# Altium project 工业控制板.PrjPcb
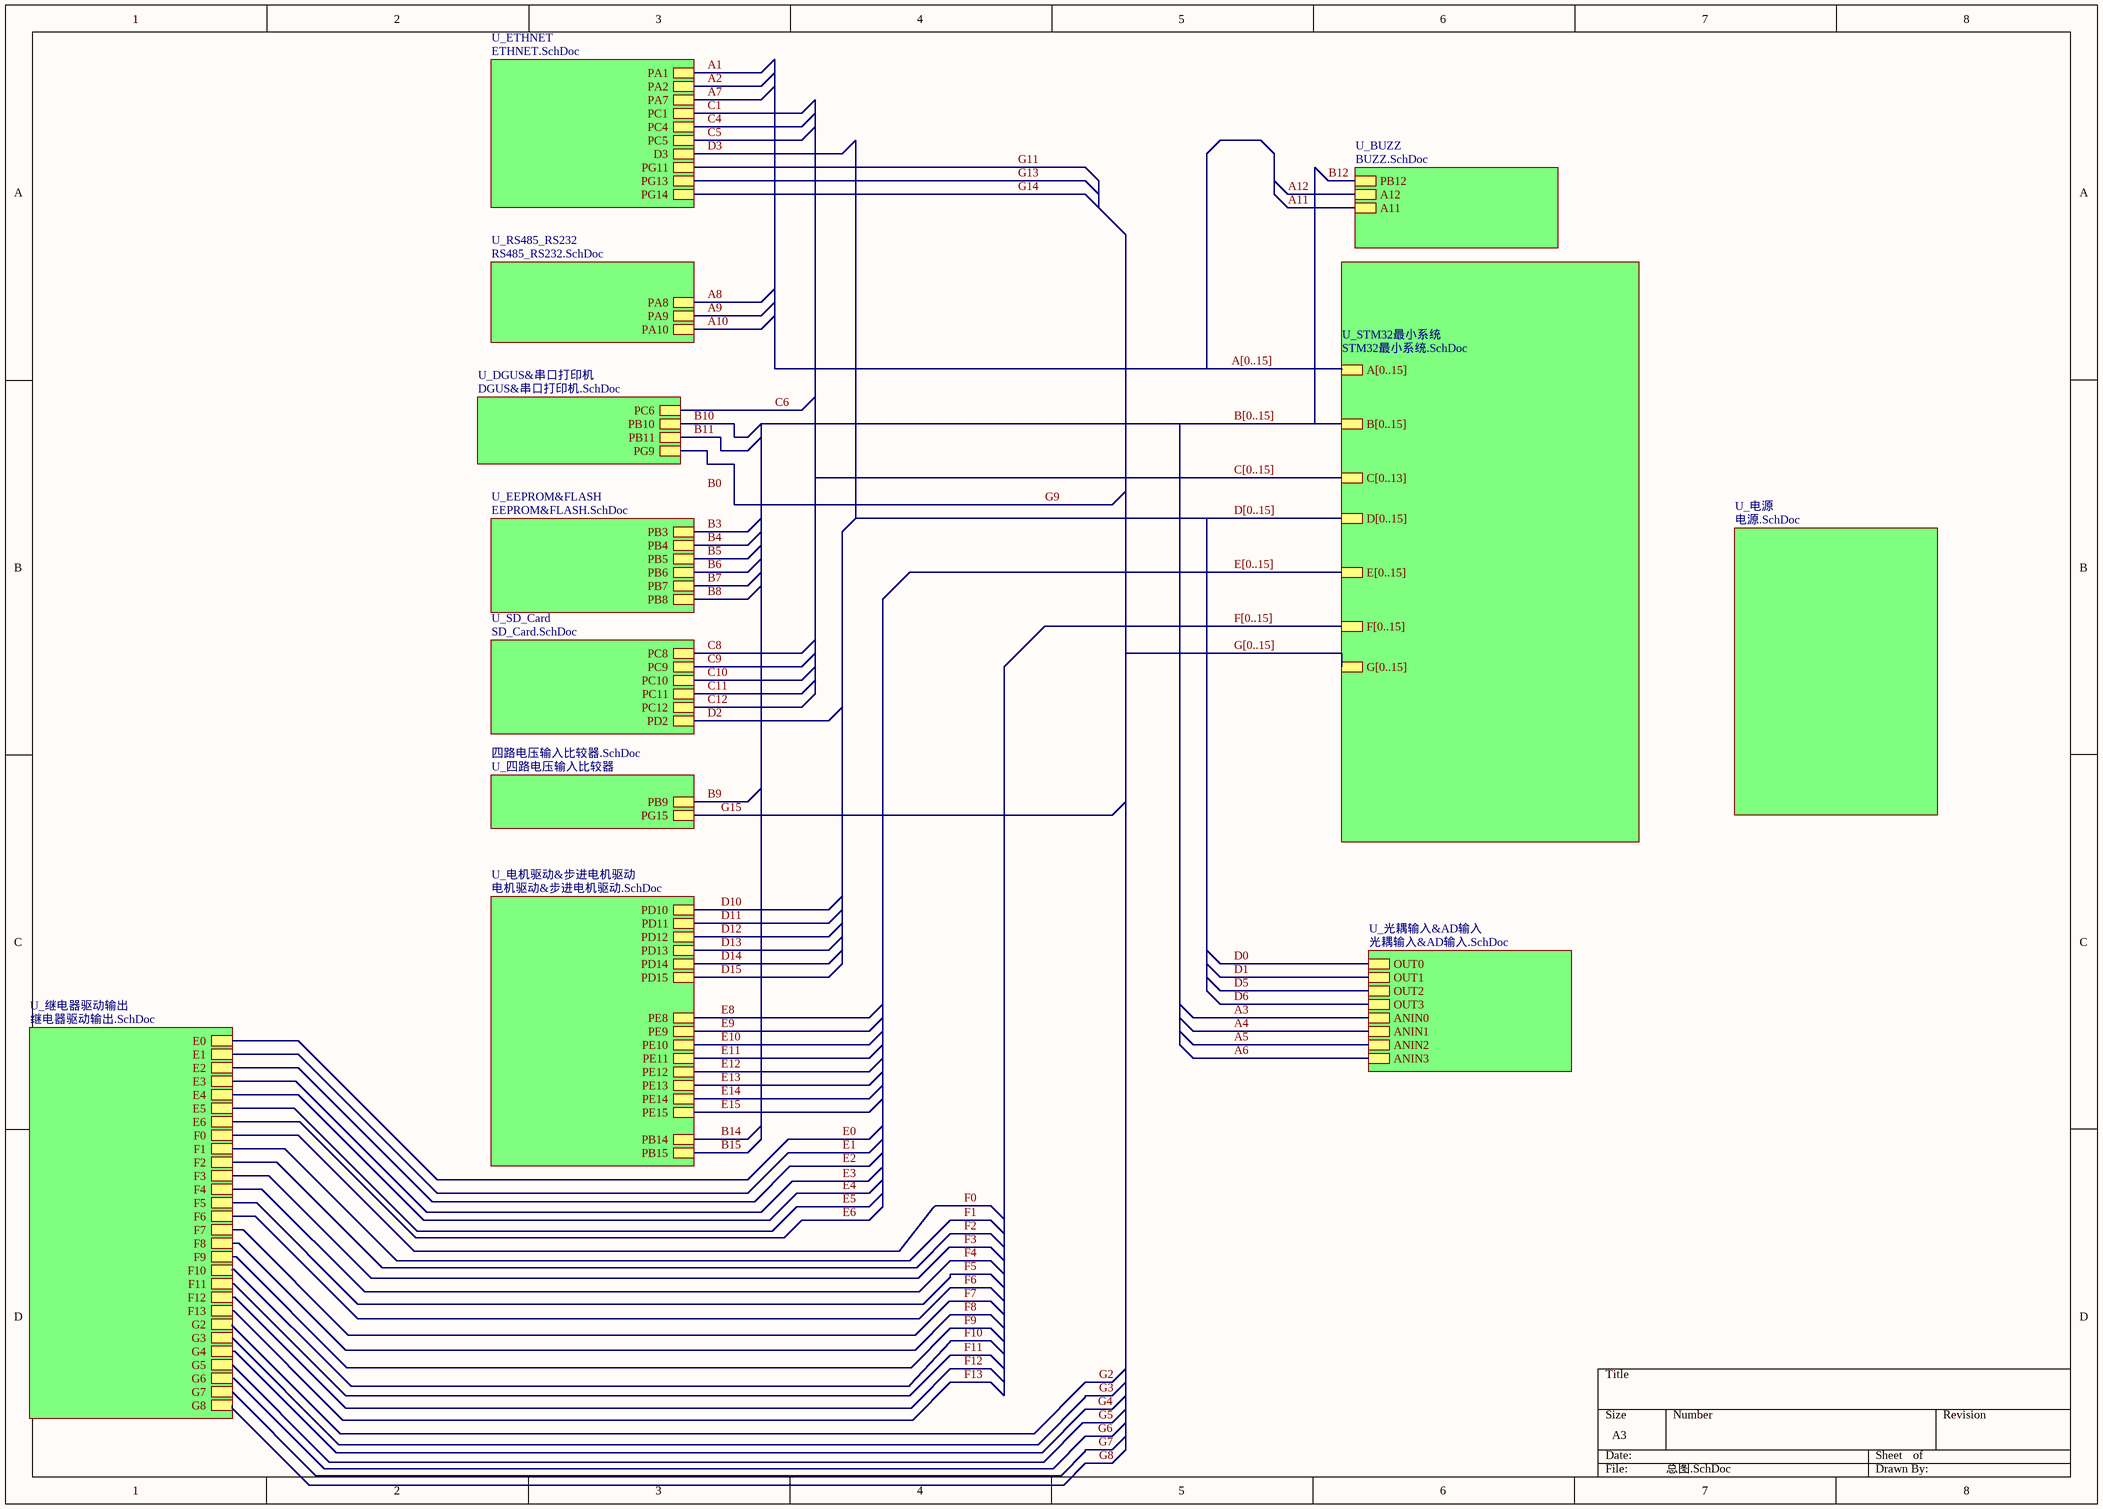
[diagram p0: 总图.SchDoc]
8 sheets, 180 parts. Net scope: hierarchical (ports join the sheet entries above them; power ports are global).
Board file: 工控板PCB.PcbDoc
Sheets:
  总图.SchDoc
    U_RS485_RS232 = RS485_RS232.SchDoc
    U_SD_Card = SD_Card.SchDoc
    U_EEPROM&FLASH = EEPROM&FLASH.SchDoc
    U_电机驱动&步进电机驱动 = 电机驱动&步进电机驱动.SchDoc
    U_继电器驱动输出 = 继电器驱动输出.SchDoc
    U_BUZZ = BUZZ.SchDoc
    U_光耦输入&AD输入 = 光耦输入&AD输入.SchDoc

## Sheet 总图.SchDoc
size A3

### Sub-sheets
U_BUZZ = BUZZ.SchDoc: PB12, A12, A11
U_DGUS&串口打印机 = DGUS&串口打印机.SchDoc (file not in this document): PG9, PB11, PC6, PB10
U_EEPROM&FLASH = EEPROM&FLASH.SchDoc: PB8, PB4, PB5, PB3, PB6, PB7
U_ETHNET = ETHNET.SchDoc (file not in this document): PA2, PC1, PG13, PG14, PG11, PC4, PC5, PA7, PA1, D3
U_RS485_RS232 = RS485_RS232.SchDoc: PA10, PA9, PA8
U_SD_Card = SD_Card.SchDoc: PC8, PC9, PC10, PC11, PC12, PD2
U_STM32最小系统 = STM32最小系统.SchDoc (file not in this document): A[0..15], B[0..15], C[0..13], D[0..15], E[0..15], F[0..15], G[0..15]
U_光耦输入&AD输入 = 光耦输入&AD输入.SchDoc: OUT0, OUT1, OUT2, OUT3, ANIN0, ANIN1, ANIN2, ANIN3
U_四路电压输入比较器 = 四路电压输入比较器.SchDoc (file not in this document): PG15, PB9
U_电机驱动&步进电机驱动 = 电机驱动&步进电机驱动.SchDoc: PE15, PE14, PE13, PE12, PE11, PE10, PE9, PE8, PD14, PD15, PB14, PB15, PD12, PD13, PD11, PD10
U_电源 = 电源.SchDoc (file not in this document): no entries
U_继电器驱动输出 = 继电器驱动输出.SchDoc: F0, F1, F2, F3, F4, F5, F6, E0, E1, E2, E3, E4, E5, E6, F7, F8, F9, F10, F11, F12, F13, G2, G3, G4, G5, G6, G7, G8

### Nets
A1: sheet U_ETHNET/PA1
A2: sheet U_ETHNET/PA2
A5: sheet U_光耦输入&AD输入/ANIN2
A6: sheet U_光耦输入&AD输入/ANIN3
A7: sheet U_ETHNET/PA7
B9: sheet U_四路电压输入比较器/PB9
B10: sheet U_DGUS&串口打印机/PB10
B11: sheet U_DGUS&串口打印机/PB11
C1: sheet U_ETHNET/PC1
C4: sheet U_ETHNET/PC4
C5: sheet U_ETHNET/PC5
C6: sheet U_DGUS&串口打印机/PC6
D3: sheet U_ETHNET/D3
D5: sheet U_光耦输入&AD输入/OUT2
D6: sheet U_光耦输入&AD输入/OUT3
G2: sheet U_继电器驱动输出/G2
G3: sheet U_继电器驱动输出/G3
G4: sheet U_继电器驱动输出/G4
G5: sheet U_继电器驱动输出/G5
G6: sheet U_继电器驱动输出/G6
G7: sheet U_继电器驱动输出/G7
G8: sheet U_继电器驱动输出/G8
G9: sheet U_DGUS&串口打印机/PG9
G11: sheet U_ETHNET/PG11
G13: sheet U_ETHNET/PG13
G14: sheet U_ETHNET/PG14
G15: sheet U_四路电压输入比较器/PG15

### Buses and harness runs
bus A[0..15] = sheet U_STM32最小系统/A[0..15]
bus B[0..15] = sheet U_STM32最小系统/B[0..15]
bus C[0..15] = sheet U_STM32最小系统/C[0..13]
bus D[0..15] = sheet U_STM32最小系统/D[0..15]
bus E[0..15] = sheet U_STM32最小系统/E[0..15]
bus F[0..15] = sheet U_STM32最小系统/F[0..15]
bus G[0..15] = sheet U_STM32最小系统/G[0..15]

### Notes on the sheet
- Labels drawn without touching a wire or pin: B0

## Sheet RS485_RS232.SchDoc
size 152 x 152 mm
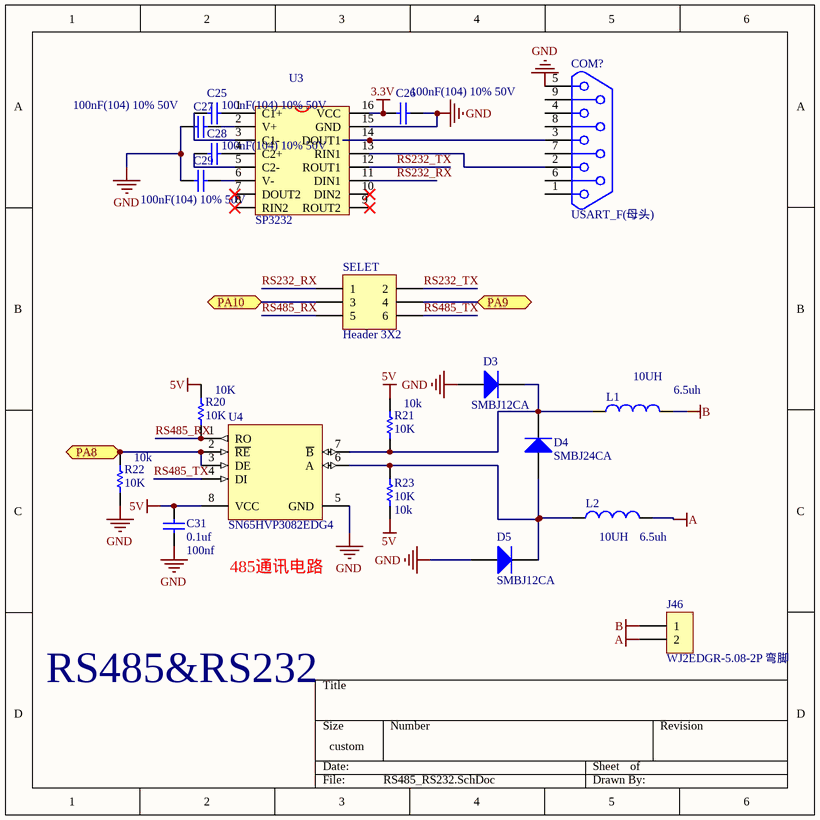
[diagram p1: RS485_RS232.SchDoc]

### Parts
C25  100nF(104) 10% 50V  [0805_C]
C26  100nF(104) 10% 50V  [0805_C]
C27  100nF(104) 10% 50V  [0805_C]
C28  100nF(104) 10% 50V  [0805_C]
C29  100nF(104) 10% 50V  [0805_C]
C31  0.1uf  value 100nf  [0805_C]
COM?  USART_F(母头)  [DB9]
D3  SMBJ12CA  [SMBJ]
D4  SMBJ24CA  [SMBJ]
D5  SMBJ12CA  [SMBJ]
J46  WJ2EDGR-5.08-2P 弯脚  [WJ2EDGR-5.08-2]
L1  10UH  value 6.5uh  [0805]
L2  10UH  value 6.5uh  [0805]
R20  10K  [0805]
R21  10K  [0805]
R22  10K  [0805]
R23  10K  [0805]
SELET  Header 3X2  [HDR2X3]
U3  SP3232  [SOP16M]
U4  SN65HVP3082EDG4  [SOIC-8_150mil]

### Ports
PA8, PA9, PA10

### Nets
3.3V: C26.2 U3.16(VCC)
5V: C31.2 R20.2 R21.2 R23.1 U4.8(VCC)
A: J46.2 L2.2
B: J46.1 L1.2
GND: C26.1 C27.1 C29.1 C31.1 COM?.5 D3.1(A) D5.1(A) R22.1 U3.15(GND) U4.5(GND)
A8: R22.2 U4.2(~{RE}) U4.3(DE) ; port PA8
A9: SELET.4 ; port PA9
A10: SELET.3 ; port PA10
RS232_RX: SELET.1 U3.11(DIN1)
RS232_TX: SELET.2 U3.12(ROUT1)
RS485_RX: R20.1 SELET.5 U4.1(RO)
RS485_TX: SELET.6 U4.4(DI)
NetC25_1: C25.1 U3.3(C1-)
NetC25_2: C25.2 U3.1(C1+)
NetC27_2: C27.2 U3.2(V+)
NetC28_1: C28.1 U3.5(C2-)
NetC28_2: C28.2 U3.4(C2+)
NetC29_2: C29.2 U3.6(V-)
NetCOM?_2: COM?.2 U3.13(RIN1)
NetCOM?_3: COM?.3 U3.14(DOUT1)
NetD3_2: D3.2(K) D4.2(K) L1.1 R21.1 U4.7(~{B})
NetD4_1: D4.1(A) D5.2(K) L2.1 R23.2 U4.6(A)

Not connected (* = marked no-connect by the designer): COM? 1 4 6 7 8 9; U3 7(DOUT2)* 8(RIN2)* 9(ROUT2)* 10(DIN2)*

### Notes on the sheet
- 485通讯电路
- RS485&RS232

### Library data of the parts
C25-C29 = 0805 100nF(104) 10% 50V: 贴片电容; ComponentLink1Description: 供应商链接; ComponentLink1URL: http://www.szlcsc.com/product/details_50686.html; Package: 0805; Supplier: LC; SuppliersPartNumber: C49678
C31 = Cap: Capacitor; Published: 8-Jun-2000; LatestRevisionDate: 17-Jul-2002; LatestRevisionNote: Re-released for DXP Platform.; PackageReference: RAD-0.3; Publisher: Altium Limited; PackageDescription: Radial Cap, Thru-Hole; 2 Leads; 0.3 in Pin Spacing
COM? = DB9
D3-D5 = SMA(DO-214AC) SS210: 二极管; ComponentLink1Description: 供应商链接; ComponentLink1URL: http://www.szlcsc.com/product/details_15669.html; Package: SMA(DO-214AC); Supplier: LC; SuppliersPartNumber: C14996
J46 = WJ2EDGR-5.08-2P 弯脚: 2EDG连接器; ComponentLink1URL: https://detail.tmall.com/item.htm?spm=a1z10.5-b.w4011-14865958799.85.B0p41N&id=45355509244&rn=e90e7252b5175cd006380c5c01151190&abbucket=9; price: 0.28; Supplier: Farpu; SuppliersPartNumber: *; Manufacturer: *; ComponentLink1Description: 供应商链接
L1 L2 = Inductor: Code_IEC: 1005; Published: 8-Jun-2000; LatestRevisionDate: 29-May-2009; LatestRevisionNote: IPC-7351 Footprint Added.; PackageReference: 0402-A; Publisher: Altium Limited; PackageDescription: Chip Inductor; Code_JEITA: 0402
R20-R23 = Res1: Resistor; Published: 8-Jun-2000; LatestRevisionDate: 17-Jul-2002; LatestRevisionNote: Re-released for DXP Platform.; PackageReference: AXIAL-0.3; Publisher: Altium Limited; PackageDescription: Axial Device, Thru-Hole; 2 Leads; 0.3 in Pin Spacing
  R20: Value: 10K
  R21-R23: Value: 10k
SELET = Header 3X2: Header, 3-Pin, Dual row; LatestRevisionDate: 17-Jul-2002; LatestRevisionNote: Re-released for DXP Platform.; Publisher: Altium Limited
U3 = MAX3232
U4 = SN75176BDR_[C7063]: RS-485/RS-422; ComponentLink1Description: 供应商链接; ComponentLink1URL: http://www.szlcsc.com/product/details_7535.html; Package: SOIC-8_150mil; Supplier: LC; SuppliersPartNumber: C7063

## Sheet SD_Card.SchDoc
size 101 x 76 mm
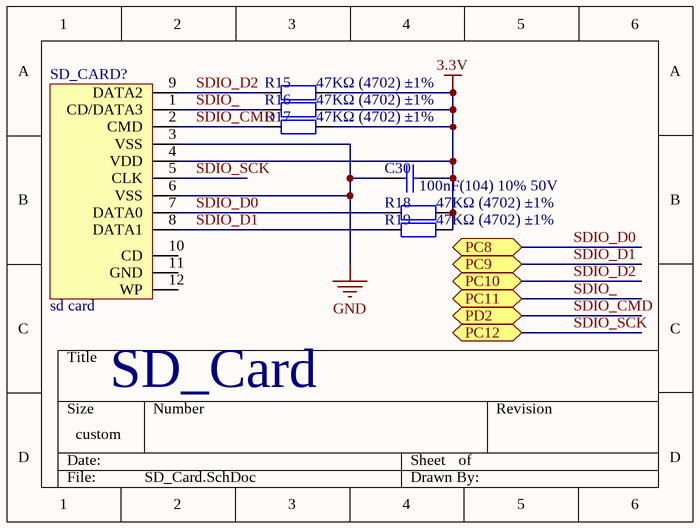
[diagram p2: SD_Card.SchDoc]

### Parts
C30  100nF(104) 10% 50V  [0805_C]
R15  47KΩ (4702) ±1%  [0805_R]
R16  47KΩ (4702) ±1%  [0805_R]
R17  47KΩ (4702) ±1%  [0805_R]
R18  47KΩ (4702) ±1%  [0805_R]
R19  47KΩ (4702) ±1%  [0805_R]
SD_CARD?  sd card  [SDCARD_L]

### Ports
PC8, PC9, PC10, PC11, PC12, PD2

### Nets
3.3V: C30.2 R15.2 R16.2 R17.2 R18.2 R19.2 SD_CARD?.4(VDD)
GND: C30.1 SD_CARD?.3(VSS) SD_CARD?.6(VSS)
SDIO_: R16.1 SD_CARD?.1(CD/DATA3) ; port PC11  [project net C11]
SDIO_CMD: R17.1 SD_CARD?.2(CMD) ; port PD2  [project net D2]
SDIO_D0: R18.1 SD_CARD?.7(DATA0) ; port PC8  [project net C8]
SDIO_D1: R19.1 SD_CARD?.8(DATA1) ; port PC9  [project net C9]
SDIO_D2: R15.1 SD_CARD?.9(DATA2) ; port PC10  [project net C10]
SDIO_SCK: SD_CARD?.5(CLK) ; port PC12  [project net C12]

Not connected (* = marked no-connect by the designer): SD_CARD? 10(CD) 11(GND) 12(WP)

### Notes on the sheet
- (near SD_CARD?) SD_Card

### Library data of the parts
C30 = 0805 100nF(104) 10% 50V: 贴片电容; ComponentLink1Description: 供应商链接; ComponentLink1URL: http://www.szlcsc.com/product/details_50686.html; Package: 0805; Supplier: LC; SuppliersPartNumber: C49678
R15-R19 = 0805 47KΩ (4702) 1%: 贴片电阻; ComponentLink1Description: 供应商链接; ComponentLink1URL: http://www.szlcsc.com/product/details_18401.html; Package: 0805; Supplier: LC; SuppliersPartNumber: C17713

## Sheet EEPROM&FLASH.SchDoc
size 101 x 101 mm
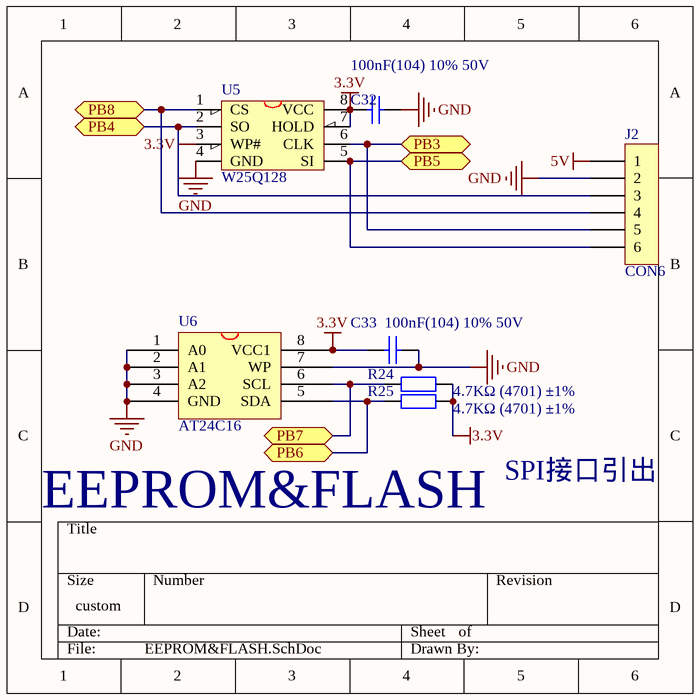
[diagram p3: EEPROM&FLASH.SchDoc]

### Parts
C32  100nF(104) 10% 50V  [0805_C]
C33  100nF(104) 10% 50V  [0805_C]
J2  CON6  [XH2.54-6P]
R24  4.7KΩ (4701) ±1%  [0805_R]
R25  4.7KΩ (4701) ±1%  [0805_R]
U5  W25Q128  [SOIC-8]
U6  AT24C16  [SOP-8]

### Ports
PB3, PB4, PB5, PB6, PB7, PB8

### Nets
3.3V: C32.1 C33.1 R24.2 R25.2 U5.3(WP#) U5.7(HOLD) U5.8(VCC) U6.8(VCC1)
5V: J2.1
GND: C32.2 C33.2 J2.2 U5.4(GND) U6.1(A0) U6.2(A1) U6.3(A2) U6.4(GND) U6.7(WP)
B3: J2.5 U5.6(CLK) ; port PB3
B4: J2.3 U5.2(SO) ; port PB4
B5: J2.6 U5.5(SI) ; port PB5
B6: R25.1 U6.5(SDA) ; port PB6
B7: R24.1 U6.6(SCL) ; port PB7
B8: J2.4 U5.1(CS) ; port PB8

### Notes on the sheet
- EEPROM&FLASH
- SPI接口引出

### Library data of the parts
C32 C33 = 0805 100nF(104) 10% 50V: 贴片电容; ComponentLink1Description: 供应商链接; ComponentLink1URL: http://www.szlcsc.com/product/details_50686.html; Package: 0805; Supplier: LC; SuppliersPartNumber: C49678
J2 = CON6: 连接器
R24 R25 = 0805 4.7KΩ (4701) 1%: 贴片电阻; ComponentLink1Description: 供应商链接; ComponentLink1URL: http://www.szlcsc.com/product/details_18361.html; Package: 0805; Supplier: LC; SuppliersPartNumber: C17673
U5 = W25X16: W25X16;SST25VF016;MX25L1605
U6 = 24C256

## Sheet 电机驱动&步进电机驱动.SchDoc
size 558 x 241 mm
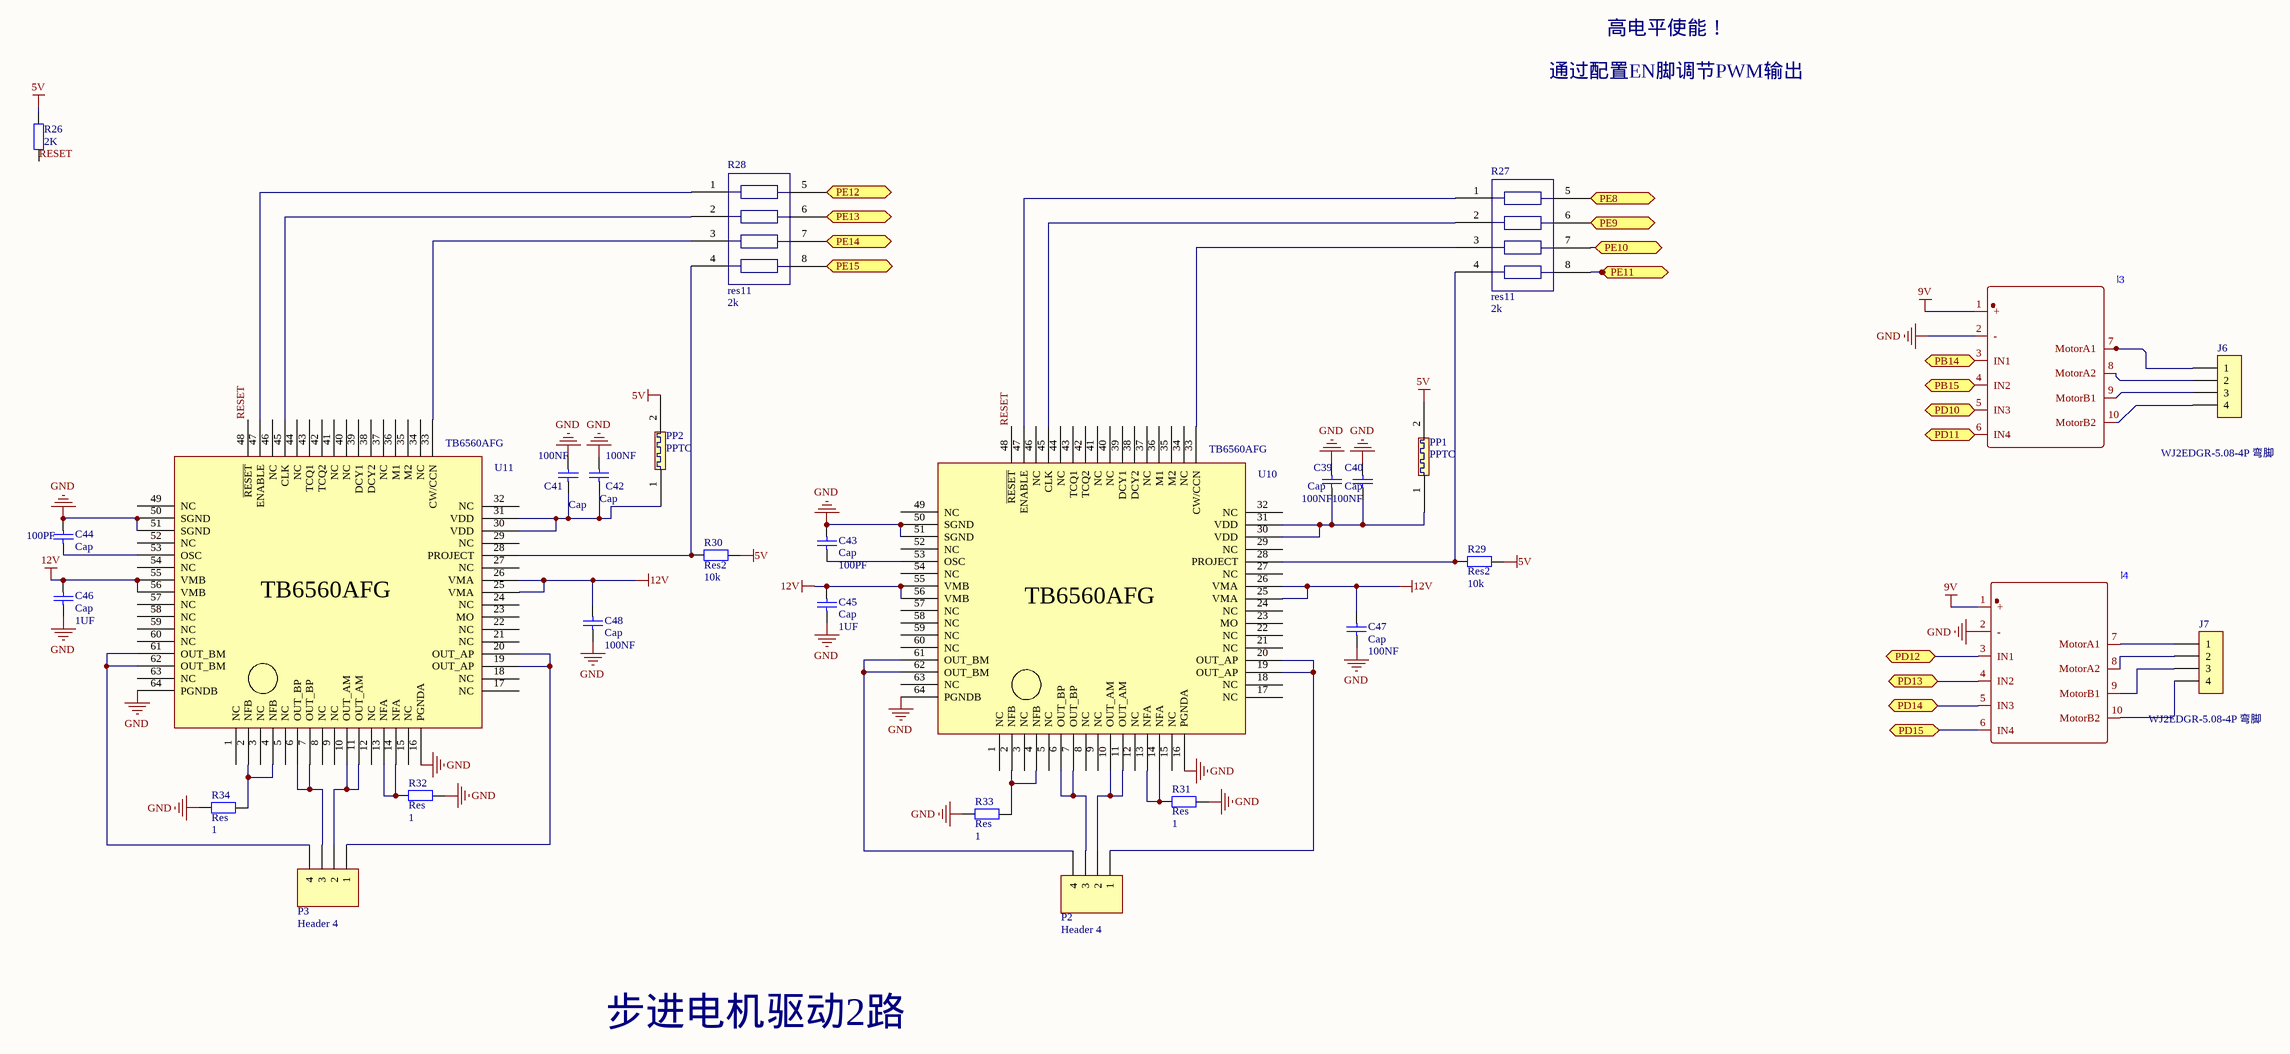
[diagram p4: 电机驱动&步进电机驱动.SchDoc]

### Parts
C39  Cap  value 100NF  [0805_C]
C40  Cap  value 100NF  [0805_C]
C41  Cap  value 100NF  [0805_C]
C42  Cap  value 100NF  [0805_C]
C43  Cap  value 100PF  [0805_C]
C44  Cap  value 100PF  [0805_C]
C45  Cap  value 1UF  [0805_C]
C46  Cap  value 1UF  [0805_C]
C47  Cap  value 100NF  [0805_C]
C48  Cap  value 100NF  [0805_C]
J6  WJ2EDGR-5.08-4P 弯脚  [WJ2EDGR-5.08-4]
J7  WJ2EDGR-5.08-4P 弯脚  [WJ2EDGR-5.08-4]
l3  (no value)  [L298N_MINI]
l4  (no value)  [L298N_MINI]
P2  Header 4  [WJ2EDGR-5.08-4]
P3  Header 4  [WJ2EDGR-5.08-4]
PP1  PPTC  [1206]
PP2  PPTC  [1206]
R26  value 2K  [0805]  (hidden comment: Res2)
R27  res11  value 2k  [RES_PACK4]
R28  res11  value 2k  [RES_PACK4]
R29  Res2  value 10k  [0805]
R30  Res2  value 10k  [0805]
R31  Res  value 1  [2512]
R32  Res  value 1  [2512]
R33  Res  value 1  [2512]
R34  Res  value 1  [2512]
U10  TB6560AFG  [TB6560AFG]
U11  TB6560AFG  [TB6560AFG]

### Ports
PB14, PB15, PD10, PD11, PD12, PD13, PD14, PD15, PE8, PE9, PE10, PE11, PE12, PE13, PE14, PE15

### Nets
5V: PP1.2(B) PP2.2(B) R26.1 R29.1 R30.1
9V: l3.1(+) l4.1(+)
12V: C45.2 C46.2 C47.1 C48.1 U10.25(VMA) U10.26(VMA) U10.55(VMB) U10.56(VMB) U11.25(VMA) U11.26(VMA) U11.55(VMB) U11.56(VMB)
GND: C39.2 C40.2 C41.2 C42.2 C43.2 C44.2 C45.1 C46.1 C47.2 C48.2 l3.2(-) l4.2(-) R31.1 R32.1 R33.2 R34.2 U10.16(PGNDA) U10.50(SGND) U10.51(SGND) U10.64(PGNDB) U11.16(PGNDA) U11.50(SGND) U11.51(SGND) U11.64(PGNDB)
B14: l3.3(IN1) ; port PB14
B15: l3.4(IN2) ; port PB15
D10: l3.5(IN3) ; port PD10
D11: l3.6(IN4) ; port PD11
D12: l4.3(IN1) ; port PD12
D13: l4.4(IN2) ; port PD13
D14: l4.5(IN3) ; port PD14
D15: l4.6(IN4) ; port PD15
E8: R27.5(PGNDB) ; port PE8
E9: R27.6(PGNDB) ; port PE9
E10: R27.7(PGNDB) ; port PE10
E11: R27.8(PGNDB) ; port PE11
E12: R28.5(PGNDB) ; port PE12
E13: R28.6(PGNDB) ; port PE13
E14: R28.7(PGNDB) ; port PE14
E15: R28.8(PGNDB) ; port PE15
RESET: R26.2 U10.48(~{RESET}) U11.48(~{RESET})
NetC39_1: C39.1 C40.1 PP1.1(B) U10.30(VDD) U10.31(VDD)
NetC41_1: C41.1 C42.1 PP2.1(B) U11.30(VDD) U11.31(VDD)
NetC43_1: C43.1 U10.53(OSC)
NetC44_1: C44.1 U11.53(OSC)
NetJ6_1: J6.1 l3.7(MotorA1)
NetJ6_2: J6.2 l3.8(MotorA2)
NetJ6_3: J6.3 l3.9(MotorB1)
NetJ6_4: J6.4 l3.10(MotorB2)
NetJ7_1: J7.1 l4.7(MotorA1)
NetJ7_2: J7.2 l4.8(MotorA2)
NetJ7_3: J7.3 l4.9(MotorB1)
NetJ7_4: J7.4 l4.10(MotorB2)
NetP2_1: P2.1 U10.19(OUT_AP) U10.20(OUT_AP)
NetP2_2: P2.2 U10.10(OUT_AM) U10.11(OUT_AM)
NetP2_3: P2.3 U10.6(OUT_BP) U10.7(OUT_BP)
NetP2_4: P2.4 U10.61(OUT_BM) U10.62(OUT_BM)
NetP3_1: P3.1 U11.19(OUT_AP) U11.20(OUT_AP)
NetP3_2: P3.2 U11.10(OUT_AM) U11.11(OUT_AM)
NetP3_3: P3.3 U11.6(OUT_BP) U11.7(OUT_BP)
NetP3_4: P3.4 U11.61(OUT_BM) U11.62(OUT_BM)
NetR27_1: R27.1(PGNDB) U10.47(ENABLE)
NetR27_2: R27.2(PGNDB) U10.45(CLK)
NetR27_3: R27.3(PGNDB) U10.33(CW/CCN)
NetR27_4: R27.4(PGNDB) R29.2 U10.28(PROJECT)
NetR28_1: R28.1(PGNDB) U11.47(ENABLE)
NetR28_2: R28.2(PGNDB) U11.45(CLK)
NetR28_3: R28.3(PGNDB) U11.33(CW/CCN)
NetR28_4: R28.4(PGNDB) R30.2 U11.28(PROJECT)
NetR31_2: R31.2 U10.13(NFA) U10.14(NFA)
NetR32_2: R32.2 U11.13(NFA) U11.14(NFA)
NetR33_1: R33.1 U10.2(NFB) U10.4(NFB)
NetR34_1: R34.1 U11.2(NFB) U11.4(NFB)

Not connected (* = marked no-connect by the designer): U10 1(NC) 3(NC) 5(NC) 8(NC) 9(NC) 12(NC) 15(NC) 17(NC) 18(NC) 21(NC) 22(NC) 23(MO) 24(NC) 27(NC) 29(NC) 32(NC) 34(NC) 35(M2) 36(M1) 37(NC) 38(DCY2) 39(DCY1) 40(NC) 41(NC) 42(TCQ2) 43(TCQ1) 44(NC) 46(NC) 49(NC) 52(NC) 54(NC) 57(NC) 58(NC) 59(NC) 60(NC) 63(NC); U11 1(NC) 3(NC) 5(NC) 8(NC) 9(NC) 12(NC) 15(NC) 17(NC) 18(NC) 21(NC) 22(NC) 23(MO) 24(NC) 27(NC) 29(NC) 32(NC) 34(NC) 35(M2) 36(M1) 37(NC) 38(DCY2) 39(DCY1) 40(NC) 41(NC) 42(TCQ2) 43(TCQ1) 44(NC) 46(NC) 49(NC) 52(NC) 54(NC) 57(NC) 58(NC) 59(NC) 60(NC) 63(NC)

### Notes on the sheet
- 高电平使能！
- 通过配置EN脚调节PWM输出
- 步进电机驱动2路

### Library data of the parts
C39-C48 = Cap: Capacitor; Published: 8-Jun-2000; LatestRevisionDate: 17-Jul-2002; LatestRevisionNote: Re-released for DXP Platform.; PackageReference: RAD-0.3; Publisher: Altium Limited; PackageDescription: Radial Cap, Thru-Hole; 2 Leads; 0.3 in Pin Spacing
J6 J7 = WJ2EDGR-5.08-4P 弯脚: 2EDG连接器; ComponentLink1URL: https://detail.tmall.com/item.htm?spm=a1z10.5-b.w4011-14865958799.85.B0p41N&id=45355509244&rn=e90e7252b5175cd006380c5c01151190&abbucket=9; price: 0.56; Supplier: Farpu; SuppliersPartNumber: *; Manufacturer: *; ComponentLink1Description: 供应商链接
l3 l4 = l298n_mini
P2 P3 = Header 4: Header, 4-Pin; LatestRevisionDate: 17-Jul-2002; LatestRevisionNote: Re-released for DXP Platform.; Publisher: Altium Limited
R26 R29-R34 = Res2: Resistor; Published: 8-Jun-2000; LatestRevisionDate: 17-Jul-2002; LatestRevisionNote: Re-released for DXP Platform.; PackageReference: AXIAL-0.4; Publisher: Altium Limited; PackageDescription: Axial Device, Thru-Hole; 2 Leads; 0.4 in Pin Spacing

## Sheet 继电器驱动输出.SchDoc
size A2
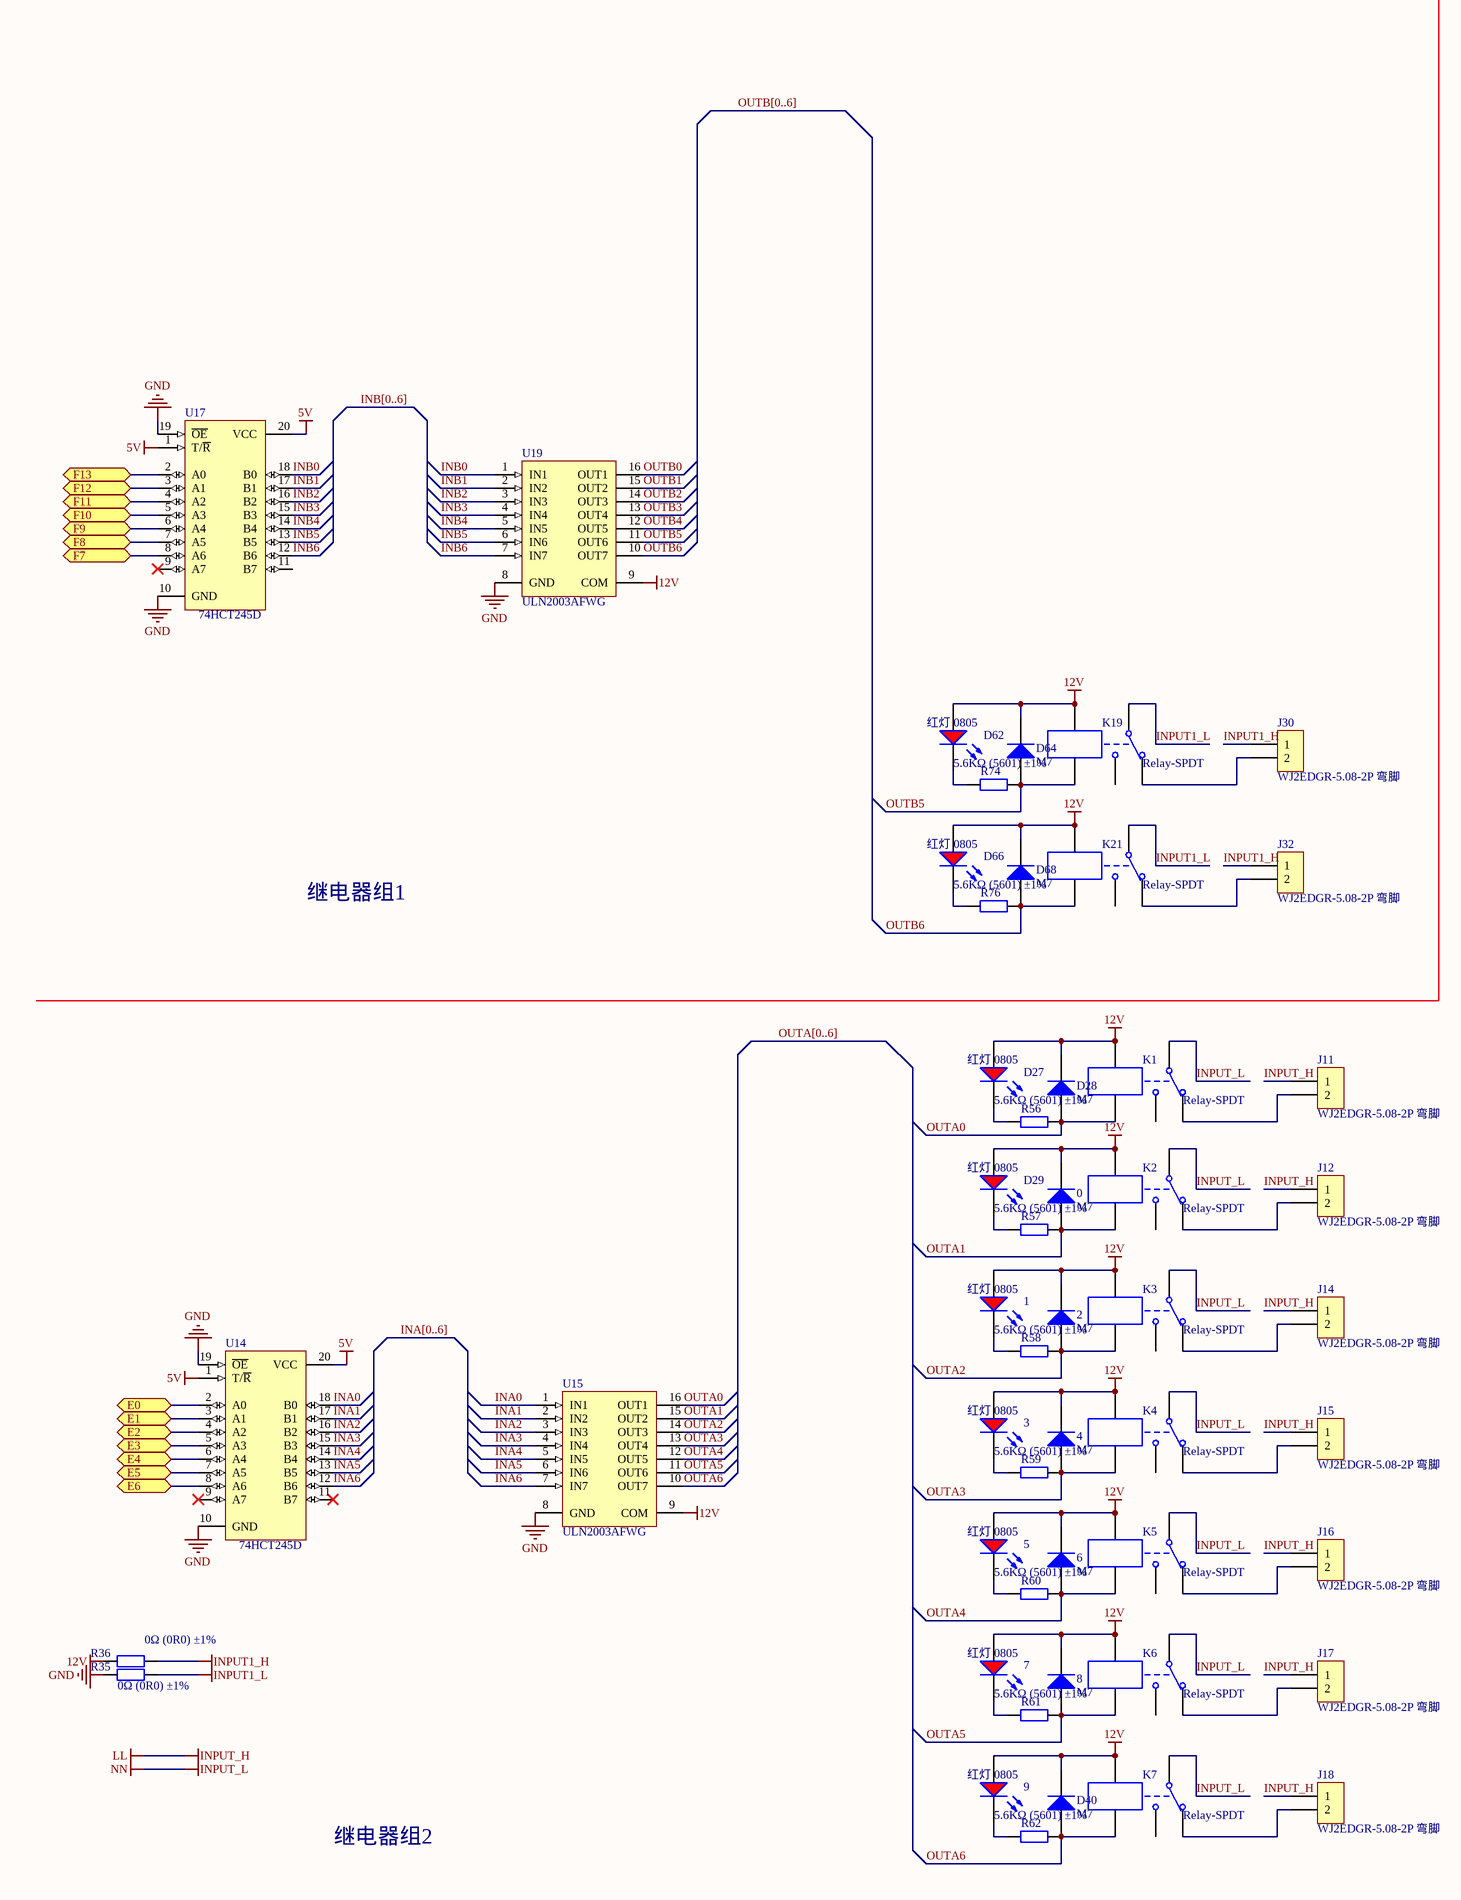
[diagram p5: 继电器驱动输出.SchDoc, left]
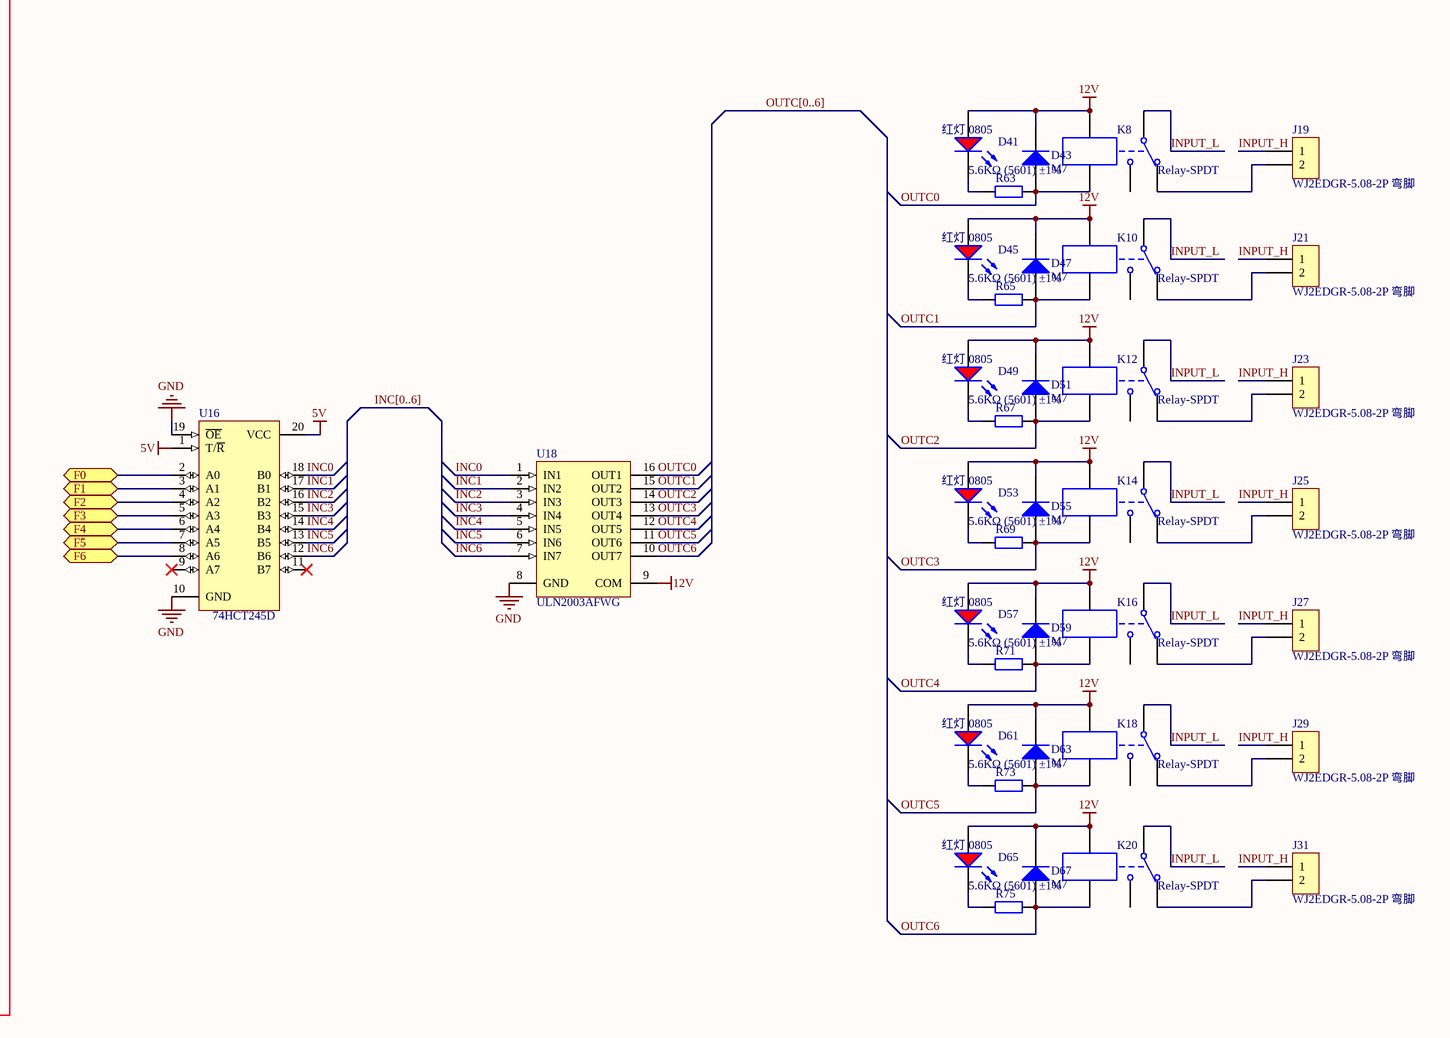
[diagram p6: 继电器驱动输出.SchDoc, right]

### Parts
0  M7  [SMA(DO-214AC)_S1]
1  红灯 0805  [0805_LED_S1]
2  M7  [SMA(DO-214AC)_S1]
3  红灯 0805  [0805_LED_S1]
4  M7  [SMA(DO-214AC)_S1]
5  红灯 0805  [0805_LED_S1]
6  M7  [SMA(DO-214AC)_S1]
7  红灯 0805  [0805_LED_S1]
8  M7  [SMA(DO-214AC)_S1]
9  红灯 0805  [0805_LED_S1]
D27  红灯 0805  [0805_LED_S1]
D28  M7  [SMA(DO-214AC)_S1]
D29  红灯 0805  [0805_LED_S1]
D40  M7  [SMA(DO-214AC)_S1]
D41  红灯 0805  [0805_LED_S1]
D43  M7  [SMA(DO-214AC)_S1]
D45  红灯 0805  [0805_LED_S1]
D47  M7  [SMA(DO-214AC)_S1]
D49  红灯 0805  [0805_LED_S1]
D51  M7  [SMA(DO-214AC)_S1]
D53  红灯 0805  [0805_LED_S1]
D55  M7  [SMA(DO-214AC)_S1]
D57  红灯 0805  [0805_LED_S1]
D59  M7  [SMA(DO-214AC)_S1]
D61  红灯 0805  [0805_LED_S1]
D62  红灯 0805  [0805_LED_S1]
D63  M7  [SMA(DO-214AC)_S1]
D64  M7  [SMA(DO-214AC)_S1]
D65  红灯 0805  [0805_LED_S1]
D66  红灯 0805  [0805_LED_S1]
D67  M7  [SMA(DO-214AC)_S1]
D68  M7  [SMA(DO-214AC)_S1]
J11  WJ2EDGR-5.08-2P 弯脚  [WJ2EDGR-5.08-2]
J12  WJ2EDGR-5.08-2P 弯脚  [WJ2EDGR-5.08-2]
J14  WJ2EDGR-5.08-2P 弯脚  [WJ2EDGR-5.08-2]
J15  WJ2EDGR-5.08-2P 弯脚  [WJ2EDGR-5.08-2]
J16  WJ2EDGR-5.08-2P 弯脚  [WJ2EDGR-5.08-2]
J17  WJ2EDGR-5.08-2P 弯脚  [WJ2EDGR-5.08-2]
J18  WJ2EDGR-5.08-2P 弯脚  [WJ2EDGR-5.08-2]
J19  WJ2EDGR-5.08-2P 弯脚  [WJ2EDGR-5.08-2]
J21  WJ2EDGR-5.08-2P 弯脚  [WJ2EDGR-5.08-2]
J23  WJ2EDGR-5.08-2P 弯脚  [WJ2EDGR-5.08-2]
J25  WJ2EDGR-5.08-2P 弯脚  [WJ2EDGR-5.08-2]
J27  WJ2EDGR-5.08-2P 弯脚  [WJ2EDGR-5.08-2]
J29  WJ2EDGR-5.08-2P 弯脚  [WJ2EDGR-5.08-2]
J30  WJ2EDGR-5.08-2P 弯脚  [WJ2EDGR-5.08-2]
J31  WJ2EDGR-5.08-2P 弯脚  [WJ2EDGR-5.08-2]
J32  WJ2EDGR-5.08-2P 弯脚  [WJ2EDGR-5.08-2]
K1  Relay-SPDT  [继电器5脚]
K2  Relay-SPDT  [继电器5脚]
K3  Relay-SPDT  [继电器5脚]
K4  Relay-SPDT  [继电器5脚]
K5  Relay-SPDT  [继电器5脚]
K6  Relay-SPDT  [继电器5脚]
K7  Relay-SPDT  [继电器5脚]
K8  Relay-SPDT  [继电器5脚]
K10  Relay-SPDT  [继电器5脚]
K12  Relay-SPDT  [继电器5脚]
K14  Relay-SPDT  [继电器5脚]
K16  Relay-SPDT  [继电器5脚]
K18  Relay-SPDT  [继电器5脚]
K19  Relay-SPDT  [继电器5脚]
K20  Relay-SPDT  [继电器5脚]
K21  Relay-SPDT  [继电器5脚]
R35  0Ω (0R0) ±1%  [1206_R]
R36  0Ω (0R0) ±1%  [1206_R]
R56  5.6KΩ (5601) ±1%  [0805_R]
R57  5.6KΩ (5601) ±1%  [0805_R]
R58  5.6KΩ (5601) ±1%  [0805_R]
R59  5.6KΩ (5601) ±1%  [0805_R]
R60  5.6KΩ (5601) ±1%  [0805_R]
R61  5.6KΩ (5601) ±1%  [0805_R]
R62  5.6KΩ (5601) ±1%  [0805_R]
R63  5.6KΩ (5601) ±1%  [0805_R]
R65  5.6KΩ (5601) ±1%  [0805_R]
R67  5.6KΩ (5601) ±1%  [0805_R]
R69  5.6KΩ (5601) ±1%  [0805_R]
R71  5.6KΩ (5601) ±1%  [0805_R]
R73  5.6KΩ (5601) ±1%  [0805_R]
R74  5.6KΩ (5601) ±1%  [0805_R]
R75  5.6KΩ (5601) ±1%  [0805_R]
R76  5.6KΩ (5601) ±1%  [0805_R]
U14  74HCT245D  [SOIC-20_300mil]
U15  ULN2003AFWG  [SOIC-16_150mil]
U16  74HCT245D  [SOIC-20_300mil]
U17  74HCT245D  [SOIC-20_300mil]
U18  ULN2003AFWG  [SOIC-16_150mil]
U19  ULN2003AFWG  [SOIC-16_150mil]

### Ports
E0, E1, E2, E3, E4, E5, E6, F0, F1, F2, F3, F4, F5, F6, F7, F8, F9, F10, F11, F12, F13

### Nets
5V: U14.1(T/~{R}) U14.20(VCC) U16.1(T/~{R}) U16.20(VCC) U17.1(T/~{R}) U17.20(VCC)
12V: 0.2(K) 1.A 2.2(K) 3.A 4.2(K) 5.A 6.2(K) 7.A 8.2(K) 9.A D27.A D28.2(K) D29.A D40.2(K) D41.A D43.2(K) D45.A D47.2(K) D49.A D51.2(K) D53.A D55.2(K) D57.A D59.2(K) D61.A D62.A D63.2(K) D64.2(K) D65.A D66.A D67.2(K) D68.2(K) K1.4 K2.4 K3.4 K4.4 K5.4 K6.4 K7.4 K8.4 K10.4 K12.4 K14.4 K16.4 K18.4 K19.4 K20.4 K21.4 R35.1 U15.9(COM) U18.9(COM) U19.9(COM)
GND: R36.1 U14.10(GND) U14.19(~{OE}) U15.8(GND) U16.10(GND) U16.19(~{OE}) U17.10(GND) U17.19(~{OE}) U18.8(GND) U19.8(GND)
INPUT1_H: J30.1 J32.1 R35.2
INPUT1_L: K19.1 K21.1 R36.2
INPUT_H: J11.1 J12.1 J14.1 J15.1 J16.1 J17.1 J18.1 J19.1 J21.1 J23.1 J25.1 J27.1 J29.1 J31.1  [also labelled LL]
INPUT_L: K1.1 K2.1 K3.1 K4.1 K5.1 K6.1 K7.1 K8.1 K10.1 K12.1 K14.1 K16.1 K18.1 K20.1  [also labelled NN]
E0: U14.2(A0) ; port E0
E1: U14.3(A1) ; port E1
E2: U14.4(A2) ; port E2
E3: U14.5(A3) ; port E3
E4: U14.6(A4) ; port E4
E5: U14.7(A5) ; port E5
E6: U14.8(A6) ; port E6
F0: U16.2(A0) ; port F0
F1: U16.3(A1) ; port F1
F2: U16.4(A2) ; port F2
F3: U16.5(A3) ; port F3
F4: U16.6(A4) ; port F4
F5: U16.7(A5) ; port F5
F6: U16.8(A6) ; port F6
F7: U17.8(A6) ; port F7
F8: U17.7(A5) ; port F8
F9: U17.6(A4) ; port F9
F10: U17.5(A3) ; port F10
F11: U17.4(A2) ; port F11
F12: U17.3(A1) ; port F12
F13: U17.2(A0) ; port F13
INA0: U14.18(B0) U15.1(IN1)
INA1: U14.17(B1) U15.2(IN2)
INA2: U14.16(B2) U15.3(IN3)
INA3: U14.15(B3) U15.4(IN4)
INA4: U14.14(B4) U15.5(IN5)
INA5: U14.13(B5) U15.6(IN6)
INA6: U14.12(B6) U15.7(IN7)
INB0: U17.18(B0) U19.1(IN1)
INB1: U17.17(B1) U19.2(IN2)
INB2: U17.16(B2) U19.3(IN3)
INB3: U17.15(B3) U19.4(IN4)
INB4: U17.14(B4) U19.5(IN5)
INB5: U17.13(B5) U19.6(IN6)
INB6: U17.12(B6) U19.7(IN7)
INC0: U16.18(B0) U18.1(IN1)
INC1: U16.17(B1) U18.2(IN2)
INC2: U16.16(B2) U18.3(IN3)
INC3: U16.15(B3) U18.4(IN4)
INC4: U16.14(B4) U18.5(IN5)
INC5: U16.13(B5) U18.6(IN6)
INC6: U16.12(B6) U18.7(IN7)
OUTA0: D28.1(A) K1.5 R56.2 U15.16(OUT1)
OUTA1: 0.1(A) K2.5 R57.2 U15.15(OUT2)
OUTA2: 2.1(A) K3.5 R58.2 U15.14(OUT3)
OUTA3: 4.1(A) K4.5 R59.2 U15.13(OUT4)
OUTA4: 6.1(A) K5.5 R60.2 U15.12(OUT5)
OUTA5: 8.1(A) K6.5 R61.2 U15.11(OUT6)
OUTA6: D40.1(A) K7.5 R62.2 U15.10(OUT7)
OUTB0: U19.16(OUT1)
OUTB1: U19.15(OUT2)
OUTB2: U19.14(OUT3)
OUTB3: U19.13(OUT4)
OUTB4: U19.12(OUT5)
OUTB5: D64.1(A) K19.5 R74.2 U19.11(OUT6)
OUTB6: D68.1(A) K21.5 R76.2 U19.10(OUT7)
OUTC0: D43.1(A) K8.5 R63.2 U18.16(OUT1)
OUTC1: D47.1(A) K10.5 R65.2 U18.15(OUT2)
OUTC2: D51.1(A) K12.5 R67.2 U18.14(OUT3)
OUTC3: D55.1(A) K14.5 R69.2 U18.13(OUT4)
OUTC4: D59.1(A) K16.5 R71.2 U18.12(OUT5)
OUTC5: D63.1(A) K18.5 R73.2 U18.11(OUT6)
OUTC6: D67.1(A) K20.5 R75.2 U18.10(OUT7)
Net1_K: 1.K R58.1
Net3_K: 3.K R59.1
Net5_K: 5.K R60.1
Net7_K: 7.K R61.1
Net9_K: 9.K R62.1
NetD27_K: D27.K R56.1
NetD29_K: D29.K R57.1
NetD41_K: D41.K R63.1
NetD45_K: D45.K R65.1
NetD49_K: D49.K R67.1
NetD53_K: D53.K R69.1
NetD57_K: D57.K R71.1
NetD61_K: D61.K R73.1
NetD62_K: D62.K R74.1
NetD65_K: D65.K R75.1
NetD66_K: D66.K R76.1
NetJ11_2: J11.2 K1.2
NetJ12_2: J12.2 K2.2
NetJ14_2: J14.2 K3.2
NetJ15_2: J15.2 K4.2
NetJ16_2: J16.2 K5.2
NetJ17_2: J17.2 K6.2
NetJ18_2: J18.2 K7.2
NetJ19_2: J19.2 K8.2
NetJ21_2: J21.2 K10.2
NetJ23_2: J23.2 K12.2
NetJ25_2: J25.2 K14.2
NetJ27_2: J27.2 K16.2
NetJ29_2: J29.2 K18.2
NetJ30_2: J30.2 K19.2
NetJ31_2: J31.2 K20.2
NetJ32_2: J32.2 K21.2

Not connected (* = marked no-connect by the designer): K1 3; K2 3; K3 3; K4 3; K5 3; K6 3; K7 3; K8 3; K10 3; K12 3; K14 3; K16 3; K18 3; K19 3; K20 3; K21 3; U14 9(A7)* 11(B7)*; U16 9(A7)* 11(B7)*; U17 9(A7)* 11(B7)

### Buses and harness runs
bus INA[0..6]
bus INB[0..6]
bus INC[0..6]
bus OUTA[0..6]
bus OUTB[0..6]
bus OUTC[0..6]

### Notes on the sheet
- 继电器组1
- 继电器组2

### Library data of the parts
0 2 4 6 8 D28 D40 D43 D47 D51 D55 D59 D63 D64 D67 D68 = SMA(DO-214AC) M7: 二极管; 备注: 1N4007 4007 编号C2464 已经停售, 使用新物料编号C95872; ComponentLink1Description: 供应商链接; ComponentLink1URL: http://www.szlcsc.com/product/details_2841.html; Package: SMA(DO-214AC); Supplier: LC; SuppliersPartNumber: C95872
1 3 5 7 9 D27 D29 D41 D45 D49 D53 D57 D61 D62 D65 D66 = 0805 红灯: 发光二极管; ComponentLink1Description: 供应商链接; ComponentLink1URL: http://www.szlcsc.com/product/details_2668.html; Package: 0805; Supplier: LC; SuppliersPartNumber: C2295
J11 J12 J14-J19 J21 J23 J25 J27 J29-J32 = WJ2EDGR-5.08-2P 弯脚: 2EDG连接器; ComponentLink1URL: https://detail.tmall.com/item.htm?spm=a1z10.5-b.w4011-14865958799.85.B0p41N&id=45355509244&rn=e90e7252b5175cd006380c5c01151190&abbucket=9; price: 0.28; Supplier: Farpu; SuppliersPartNumber: *; Manufacturer: *; ComponentLink1Description: 供应商链接
K1-K8 K10 K12 K14 K16 K18-K21 = Relay-SPDT: Single-Pole Dual-Throw Relay; Published: 24-Mar-1999; LatestRevisionDate: 17-Jul-2002; LatestRevisionNote: Re-released for DXP Platform.; PackageReference: MODULE5B; Publisher: Altium Limited
R35 R36 = 1206 0Ω (0R0) 1%: 贴片电阻; ComponentLink1Description: 供应商链接; ComponentLink1URL: http://www.szlcsc.com/product/details_18576.html; Package: 1206; Supplier: LC; SuppliersPartNumber: C17888
R56-R63 R65 R67 R69 R71 R73-R76 = 0805 5.6KΩ (5601) 1%: 贴片电阻; ComponentLink1Description: 供应商链接; ComponentLink1URL: http://www.szlcsc.com/product/details_4789.html; Package: 0805; Supplier: LC; SuppliersPartNumber: C4382
U14 U16 U17 = 74HC245D_[C5625]: 74系列逻辑芯片; ComponentLink1Description: 供应商链接; ComponentLink1URL: http://www.szlcsc.com/product/details_6076.html; Package: SOIC-20_300mil; Supplier: LC; SuppliersPartNumber: C5625
U15 U18 U19 = ULN2003AFWG_[C5437]: 大电流驱动; ComponentLink1Description: 供应商链接; ComponentLink1URL: http://www.szlcsc.com/product/details_5880.html; Package: SOIC-16_150mil; Supplier: LC; SuppliersPartNumber: C5437

## Sheet BUZZ.SchDoc
size A4
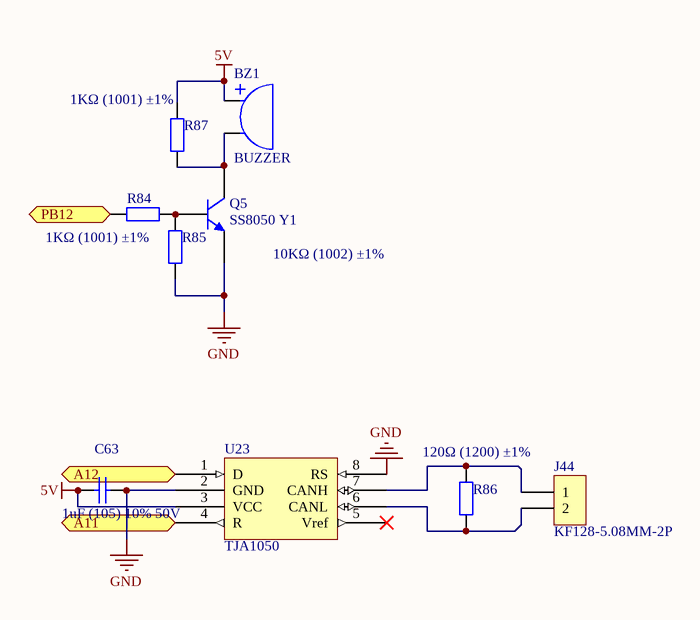
[diagram p7: BUZZ.SchDoc]

### Parts
BZ1  BUZZER  [BUZZER-D12.0X8.5-6.5-0.8]
C63  1uF (105) 10% 50V  [0805_C]
J44  KF128-5.08MM-2P  [WJ2EDGR-5.08-2]
Q5  SS8050 Y1  [SOT-23(SOT-23-3)]
R84  1KΩ (1001) ±1%  [0805_R]
R85  10KΩ (1002) ±1%  [0805_R]
R86  120Ω (1200) ±1%  [0805_R]
R87  1KΩ (1001) ±1%  [0805_R]
U23  TJA1050  [SOP-8]

### Ports
A11, A12, PB12

### Nets
5V: BZ1.1 C63.1 R87.2 U23.3(VCC)
GND: C63.2 Q5.2(E) R85.1 U23.2(GND) U23.8(RS)
A11: U23.4(R) ; port A11
A12: U23.1(D) ; port A12
B12: R84.1 ; port PB12
NetBZ1_2: BZ1.2 Q5.3(C) R87.1
NetJ44_1: J44.1 R86.2 U23.7(CANH)
NetJ44_2: J44.2 R86.1 U23.6(CANL)
NetQ5_1: Q5.1(B) R84.2 R85.2

Not connected (* = marked no-connect by the designer): U23 5(Vref)*

### Library data of the parts
C63 = 0805 1uF (105) 10% 50V: 贴片电容; ComponentLink1Description: 供应商链接; ComponentLink1URL: http://www.szlcsc.com/product/details_29074.html; Package: 0805; Supplier: LC; SuppliersPartNumber: C28323
J44 = KF128-5.08MM-2P: 接线端子; ComponentLink1URL: https://detail.tmall.com/item.htm?spm=a1z10.5-b.w4011-14865958799.193.B0p41N&id=45905508377&rn=e90e7252b5175cd006380c5c01151190&abbucket=9; price: 0.5; Supplier: Farpu; SuppliersPartNumber: *; Manufacturer: *; ComponentLink1Description: 供应商链接
Q5 = SOT-23 SS8050 Y1: 三极管; ComponentLink1Description: 供应商链接; ComponentLink1URL: http://www.szlcsc.com/product/details_2507.html; Package: SOT-23; Supplier: LC; SuppliersPartNumber: C2150
R84 R87 = 0805 1KΩ (1001) 1%: 贴片电阻; ComponentLink1Description: 供应商链接; ComponentLink1URL: http://www.szlcsc.com/product/details_18201.html; Package: 0805; Supplier: LC; SuppliersPartNumber: C17513
R85 = 0805 10KΩ (1002) 1%: 贴片电阻; ComponentLink1Description: 供应商链接; ComponentLink1URL: http://www.szlcsc.com/product/details_18102.html; Package: 0805; Supplier: LC; SuppliersPartNumber: C17414
R86 = 0805 120Ω (1200) 1%: 贴片电阻; ComponentLink1Description: 供应商链接; ComponentLink1URL: http://www.szlcsc.com/product/details_18125.html; Package: 0805; Supplier: LC; SuppliersPartNumber: C17437
U23 = SN65HVD230D

## Sheet 光耦输入&AD输入.SchDoc
size A4
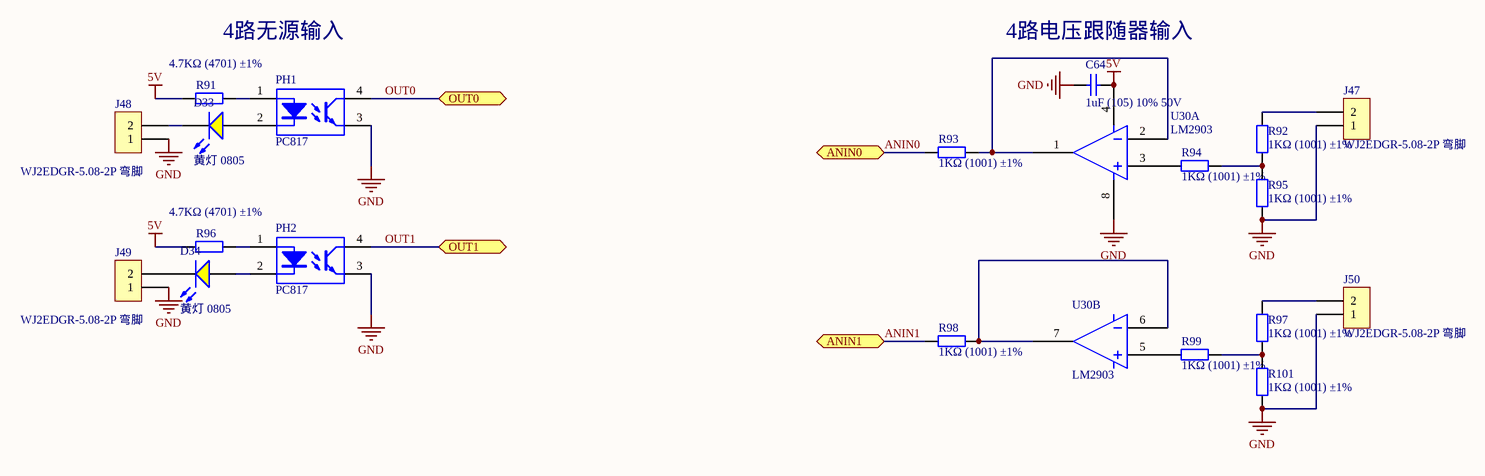
[diagram p8: 光耦输入&AD输入.SchDoc]

### Parts
C64  1uF (105) 10% 50V  [0805_C]
D33  黄灯 0805  [0805_LED_S1]
D34  黄灯 0805  [0805_LED_S1]
J47  WJ2EDGR-5.08-2P 弯脚  [WJ2EDGR-5.08-2]
J48  WJ2EDGR-5.08-2P 弯脚  [WJ2EDGR-5.08-2]
J49  WJ2EDGR-5.08-2P 弯脚  [WJ2EDGR-5.08-2]
J50  WJ2EDGR-5.08-2P 弯脚  [WJ2EDGR-5.08-2]
PH1  PC817  [SOP-4_P2.54]
PH2  PC817  [SOP-4_P2.54]
R91  4.7KΩ (4701) ±1%  [0805_R]
R92  1KΩ (1001) ±1%  [0805_R]
R93  1KΩ (1001) ±1%  [0805_R]
R94  1KΩ (1001) ±1%  [0805_R]
R95  1KΩ (1001) ±1%  [0805_R]
R96  4.7KΩ (4701) ±1%  [0805_R]
R97  1KΩ (1001) ±1%  [0805_R]
R98  1KΩ (1001) ±1%  [0805_R]
R99  1KΩ (1001) ±1%  [0805_R]
R101  1KΩ (1001) ±1%  [0805_R]
U30  LM2903  [SOP-8]  (parts A,B of 2)

### Ports
ANIN0, ANIN1, OUT0, OUT1

### Nets
5V: C64.2 R91.1 R96.1 U30.4
GND: C64.1 J47.1 J48.1 J49.1 J50.1 PH1.3(E) PH2.3(E) R95.1 R101.1 U30.8
ANIN0: R93.2 ; port ANIN0  [project net A3]
ANIN1: R98.2 ; port ANIN1  [project net A4]
OUT0: PH1.4(C) ; port OUT0  [project net D0]
OUT1: PH2.4(C) ; port OUT1  [project net D1]
NetD33_A: D33.A PH1.2(K)
NetD33_K: D33.K J48.2
NetD34_A: D34.A PH2.2(K)
NetD34_K: D34.K J49.2
NetJ47_2: J47.2 R92.2
NetJ50_2: J50.2 R97.2
NetPH1_1: PH1.1(A) R91.2
NetPH2_1: PH2.1(A) R96.2
NetR92_1: R92.1 R94.1 R95.2
NetR93_1: R93.1 U30.1 U30.2
NetR94_2: R94.2 U30.3
NetR97_1: R97.1 R99.1 R101.2
NetR98_1: R98.1 U30.6 U30.7
NetR99_2: R99.2 U30.5

### Notes on the sheet
- 4路无源输入
- (near C64) 4路电压跟随器输入

### Library data of the parts
C64 = 0805 1uF (105) 10% 50V: 贴片电容; ComponentLink1Description: 供应商链接; ComponentLink1URL: http://www.szlcsc.com/product/details_29074.html; Package: 0805; Supplier: LC; SuppliersPartNumber: C28323
D33 D34 = 0805 黄灯: 发光二极管; ComponentLink1Description: 供应商链接; ComponentLink1URL: http://www.szlcsc.com/product/details_2669.html; Package: 0805; Supplier: LC; SuppliersPartNumber: C2296
J47-J50 = WJ2EDGR-5.08-2P 弯脚: 2EDG连接器; ComponentLink1URL: https://detail.tmall.com/item.htm?spm=a1z10.5-b.w4011-14865958799.85.B0p41N&id=45355509244&rn=e90e7252b5175cd006380c5c01151190&abbucket=9; price: 0.28; Supplier: Farpu; SuppliersPartNumber: *; Manufacturer: *; ComponentLink1Description: 供应商链接
PH1 PH2 = PC817: Optoisolator
R91 R96 = 0805 4.7KΩ (4701) 1%: 贴片电阻; ComponentLink1Description: 供应商链接; ComponentLink1URL: http://www.szlcsc.com/product/details_18361.html; Package: 0805; Supplier: LC; SuppliersPartNumber: C17673
R92-R95 R97-R99 R101 = 0805 1KΩ (1001) 1%: 贴片电阻; ComponentLink1Description: 供应商链接; ComponentLink1URL: http://www.szlcsc.com/product/details_18201.html; Package: 0805; Supplier: LC; SuppliersPartNumber: C17513
U30 = LM193

## Nets that join several sheets
3.3V: RS485_RS232 (C26.2 U3.16), SD_Card (7 pins), EEPROM&FLASH (8 pins)
5V: RS485_RS232 (5 pins), EEPROM&FLASH (J2.1), 电机驱动&步进电机驱动 (5 pins), 继电器驱动输出 (6 pins), BUZZ (BZ1.1 C63.1 R87.2 U23.3), 光耦输入&AD输入 (C64.2 R91.1 R96.1 U30.4)
12V: 电机驱动&步进电机驱动 (12 pins), 继电器驱动输出 (52 pins)
GND: RS485_RS232 (10 pins), SD_Card (C30.1 SD_CARD?.3 SD_CARD?.6), EEPROM&FLASH (9 pins), 电机驱动&步进电机驱动 (24 pins), 继电器驱动输出 (10 pins), BUZZ (5 pins), 光耦输入&AD输入 (10 pins)